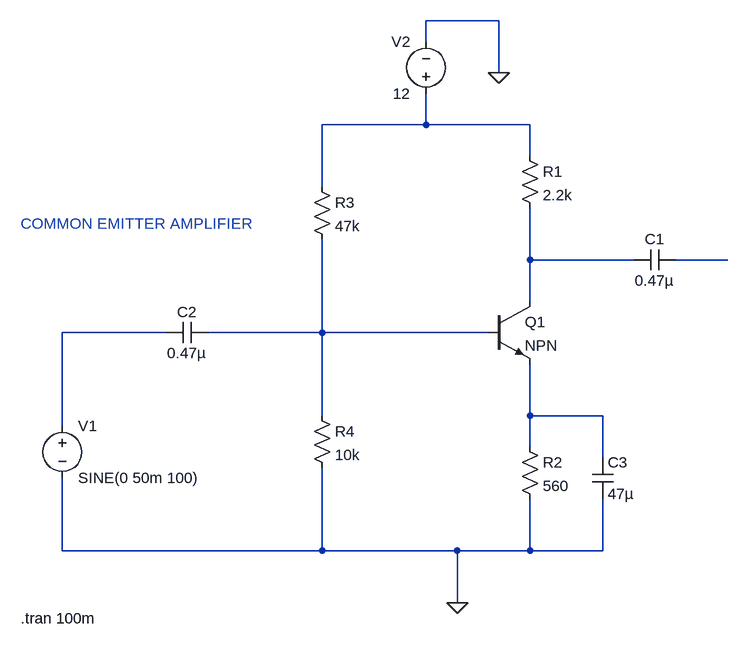
[diagram p0: schematic common emitter amplifier.asc]
common emitter amplifier.asc, the LTspice schematic file:
Version 4
SHEET 1 880 680
WIRE 176 -320 64 -320
WIRE 64 -288 64 -320
WIRE 176 -240 176 -320
WIRE 64 -160 64 -208
WIRE 64 -160 -96 -160
WIRE 224 -160 64 -160
WIRE 224 -112 224 -160
WIRE -96 -64 -96 -160
WIRE 224 48 224 -32
WIRE 384 48 224 48
WIRE 528 48 448 48
WIRE 224 112 224 48
WIRE -336 160 -496 160
WIRE -96 160 -96 16
WIRE -96 160 -272 160
WIRE 160 160 -96 160
WIRE -96 288 -96 160
WIRE 224 288 224 208
WIRE 336 288 224 288
WIRE -496 304 -496 160
WIRE 224 336 224 288
WIRE 336 352 336 288
WIRE -496 496 -496 384
WIRE -96 496 -96 368
WIRE -96 496 -496 496
WIRE 112 496 -96 496
WIRE 224 496 224 416
WIRE 224 496 112 496
WIRE 336 496 336 416
WIRE 336 496 224 496
WIRE 112 576 112 496
FLAG 112 576 0
FLAG 176 -240 0
SYMBOL npn 160 112 R0
SYMATTR InstName Q1
SYMBOL res 208 -128 R0
SYMATTR InstName R1
SYMATTR Value 2.2k
SYMBOL res 208 320 R0
SYMATTR InstName R2
SYMATTR Value 560
SYMBOL res -112 -80 R0
SYMATTR InstName R3
SYMATTR Value 47k
SYMBOL res -112 272 R0
SYMATTR InstName R4
SYMATTR Value 10k
SYMBOL cap 384 64 R270
WINDOW 0 32 32 VTop 2
WINDOW 3 0 32 VBottom 2
SYMATTR InstName C1
SYMATTR Value 0.47µ
SYMBOL cap -336 176 R270
WINDOW 0 32 32 VTop 2
WINDOW 3 0 32 VBottom 2
SYMATTR InstName C2
SYMATTR Value 0.47µ
SYMBOL voltage -496 288 R0
WINDOW 123 0 0 Left 0
WINDOW 39 0 0 Left 0
SYMATTR InstName V1
SYMATTR Value SINE(0 50m 100)
SYMBOL voltage 64 -192 R180
WINDOW 0 24 96 Left 2
WINDOW 3 24 16 Left 2
WINDOW 123 0 0 Left 0
WINDOW 39 0 0 Left 0
SYMATTR InstName V2
SYMATTR Value 12
SYMBOL cap 320 352 R0
SYMATTR InstName C3
SYMATTR Value 47µ
TEXT -560 -8 Left 2 ;COMMON EMITTER AMPLIFIER
TEXT -560 600 Left 2 !.tran 100m

The netlist it stands for:
* common emitter amplifier.asc
Q1 N002 N005 N006 0 NPN
R1 N001 N002 2.2k
R2 N006 0 560
R3 N001 N005 47k
R4 N005 0 10k
C1 N002 N003 0.47µ
C2 N004 N005 0.47µ
V1 N004 0 SINE(0 50m 100)
V2 N001 0 12
C3 N006 0 47µ
.model NPN NPN
.model PNP PNP
.lib standard.bjt
* COMMON EMITTER AMPLIFIER
.tran 100m
.backanno
.end